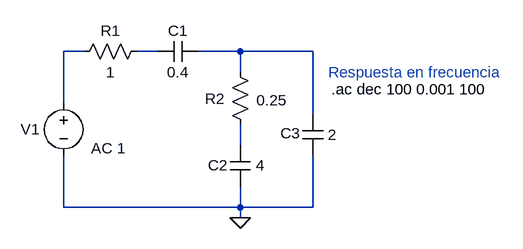
[diagram p0: schematic EJ2.asc]
EJ2.asc, the LTspice schematic file:
Version 4
SHEET 1 880 680
WIRE -48 96 -80 96
WIRE 64 96 32 96
WIRE 192 96 128 96
WIRE 304 96 192 96
WIRE 192 128 192 96
WIRE -80 176 -80 96
WIRE 304 192 304 96
WIRE 192 240 192 208
WIRE -80 336 -80 256
WIRE 192 336 192 304
WIRE 192 336 -80 336
WIRE 304 336 304 256
WIRE 304 336 192 336
WIRE 192 352 192 336
FLAG 192 352 0
SYMBOL res 48 80 R90
WINDOW 0 0 56 VBottom 2
WINDOW 3 32 56 VTop 2
SYMATTR InstName R1
SYMATTR Value 1
SYMBOL cap 128 80 R90
WINDOW 0 0 32 VBottom 2
WINDOW 3 32 32 VTop 2
SYMATTR InstName C1
SYMATTR Value 0.4
SYMBOL res 176 112 R0
WINDOW 0 -38 57 Left 2
WINDOW 3 41 59 Left 2
SYMATTR InstName R2
SYMATTR Value 0.25
SYMBOL cap 176 240 R0
WINDOW 0 -34 31 Left 2
WINDOW 3 40 31 Left 2
SYMATTR InstName C2
SYMATTR Value 4
SYMBOL cap 288 192 R0
WINDOW 0 -34 30 Left 2
WINDOW 3 39 32 Left 2
SYMATTR InstName C3
SYMATTR Value 2
SYMBOL voltage -80 160 R0
WINDOW 0 -66 56 Left 2
WINDOW 3 42 57 Left 2
WINDOW 123 42 85 Left 2
WINDOW 39 0 0 Left 0
SYMATTR InstName V1
SYMATTR Value ""
SYMATTR Value2 AC 1
TEXT 328 128 Left 2 ;Respuesta en frecuencia
TEXT 332 154 Left 2 !.ac dec 100 0.001 100

The netlist it stands for:
* EJ2.asc
R1 N002 N001 1
C1 N003 N002 0.4
R2 N003 N004 0.25
C2 N004 0 4
C3 N003 0 2
V1 N001 0 AC 1
* Respuesta en frecuencia
.ac dec 100 0.001 100
.backanno
.end